# Altium schematic sheet peripherals.SchDoc
size A4; DrawnBy: Forrest Gu; DocumentNumber: 3; Revision: 1.0; SheetNumber: 3; SheetTotal: 5
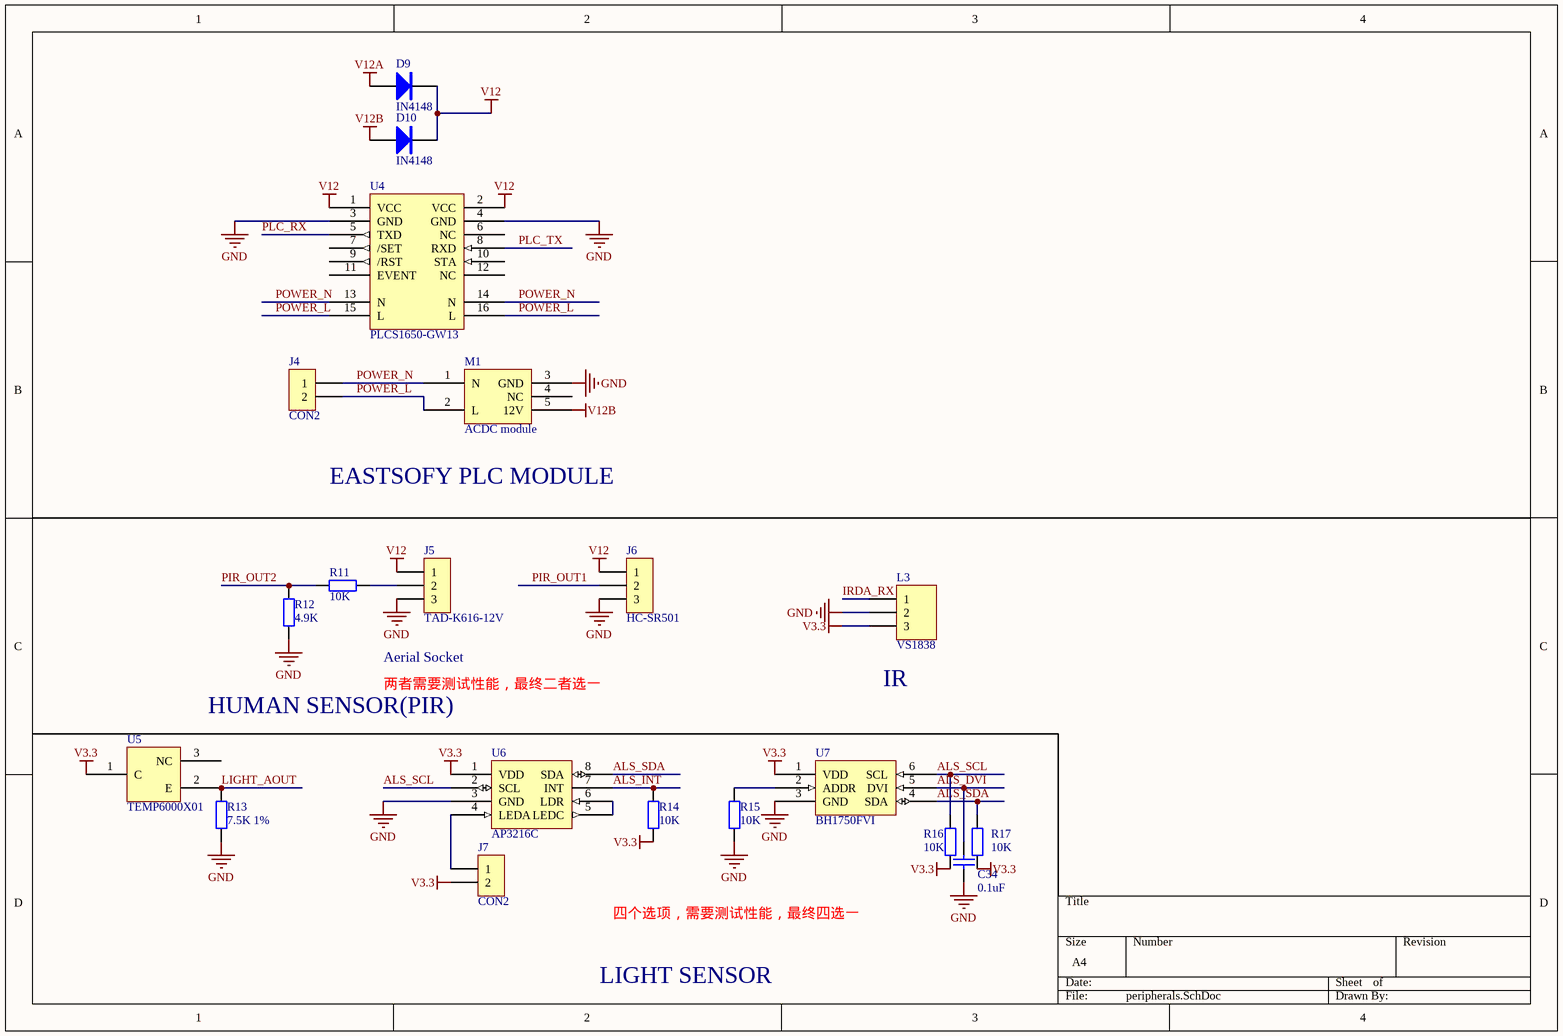
[diagram p0: peripherals.SchDoc]

## Parts
C34  0.1uF  [0805C]
D9  IN4148  [SOD323]
D10  IN4148  [SOD323]
J4  CON2  [SIP2]
J5  TAD-K616-12V  [SIP-3]
J6  HC-SR501  [SIP-3]
J7  CON2  [SIP2]
L3  VS1838  [HDR1X3]
M1  ACDC module
R11  10K  [0805R]
R12  4.9K  [0805R]
R13  7.5K 1%  [0805R]
R14  10K  [0805R]
R15  10K  [0805R]
R16  10K  [0805R]
R17  10K  [0805R]
U4  PLCS1650-GW13  [PLCS1650-GW13]
U5  TEMP6000X01  [TEMP6000X01]
U6  AP3216C  [AP3216C]
U7  BH1750FVI  [BH1750FVI]

## Nets
GND: C34.2 J5.3 J6.3 L3.2 M1.3(GND) R12.1 R13.1 R15.1 U4.3(GND) U4.4(GND) U6.3(GND) U7.3(GND)
V3.3: J7.2 L3.3 R14.1 R16.1 R17.1 U5.1(C) U6.1(VDD) U7.1(VDD)
V12: D9.K D10.K J5.1 J6.1 U4.1(VCC) U4.2(VCC)
V12A: D9.A
V12B: D10.A M1.5(12V)
ALS_DVI: C34.1 U7.5(DVI)
ALS_INT: R14.2 U6.7(INT)
ALS_SCL: R16.2 U6.2(SCL) U7.6(SCL)
ALS_SDA: R17.2 U6.8(SDA) U7.4(SDA)
IRDA_RX: L3.1
LIGHT_AOUT: R13.2 U5.2(E)
PIR_OUT1: J6.2
PIR_OUT2: R11.2 R12.2
PLC_RX: U4.5(TXD)
PLC_TX: U4.8(RXD)
POWER_L: J4.2 M1.2(L) U4.15(L) U4.16(L)
POWER_N: J4.1 M1.1(N) U4.13(N) U4.14(N)
NetJ5_2: J5.2 R11.1
NetJ7_1: J7.1 U6.4(LEDA)
NetR15_2: R15.2 U7.2(ADDR)
NetU6_5: U6.5(LEDC) U6.6(LDR)

Not connected (* = marked no-connect by the designer): M1 4(NC); U4 6(NC) 7(/SET) 9(/RST) 10(STA) 11(EVENT) 12(NC); U5 3(NC)

## Notes on the sheet
- EASTSOFY PLC MODULE
- HUMAN SENSOR(PIR)
- Aerial Socket
- 两者需要测试性能，最终二者选一
- (near L3) IR
- 四个选项，需要测试性能，最终四选一
- LIGHT SENSOR

## Library data of the parts
C34 = Cap: Capacitor; Published: 8-Jun-2000; LatestRevisionDate: 17-Jul-2002; LatestRevisionNote: Re-released for DXP Platform.; PackageReference: RAD-0.3; Publisher: Altium Limited; Value: 0.1uF
D9 D10 = DIODE
J5 J6 = CON3: Connector
L3 = Header 3: Header, 3-Pin; LatestRevisionDate: 17-Jul-2002; LatestRevisionNote: Re-released for DXP Platform.; Publisher: Altium Limited
M1 = ACDC module: 220v AC - 12DC module
R11-R17 = Res2: Resistor; Value: 1K; Published: 8-Jun-2000; LatestRevisionDate: 17-Jul-2002; LatestRevisionNote: Re-released for DXP Platform.; PackageReference: AXIAL-0.4; Publisher: Altium Limited
U4 = PLCS1650-GW13: Eastsoft PLC module